# EAGLE schematic Eurorack_Pot_CV_Summed (EAGLE 9.6.2)
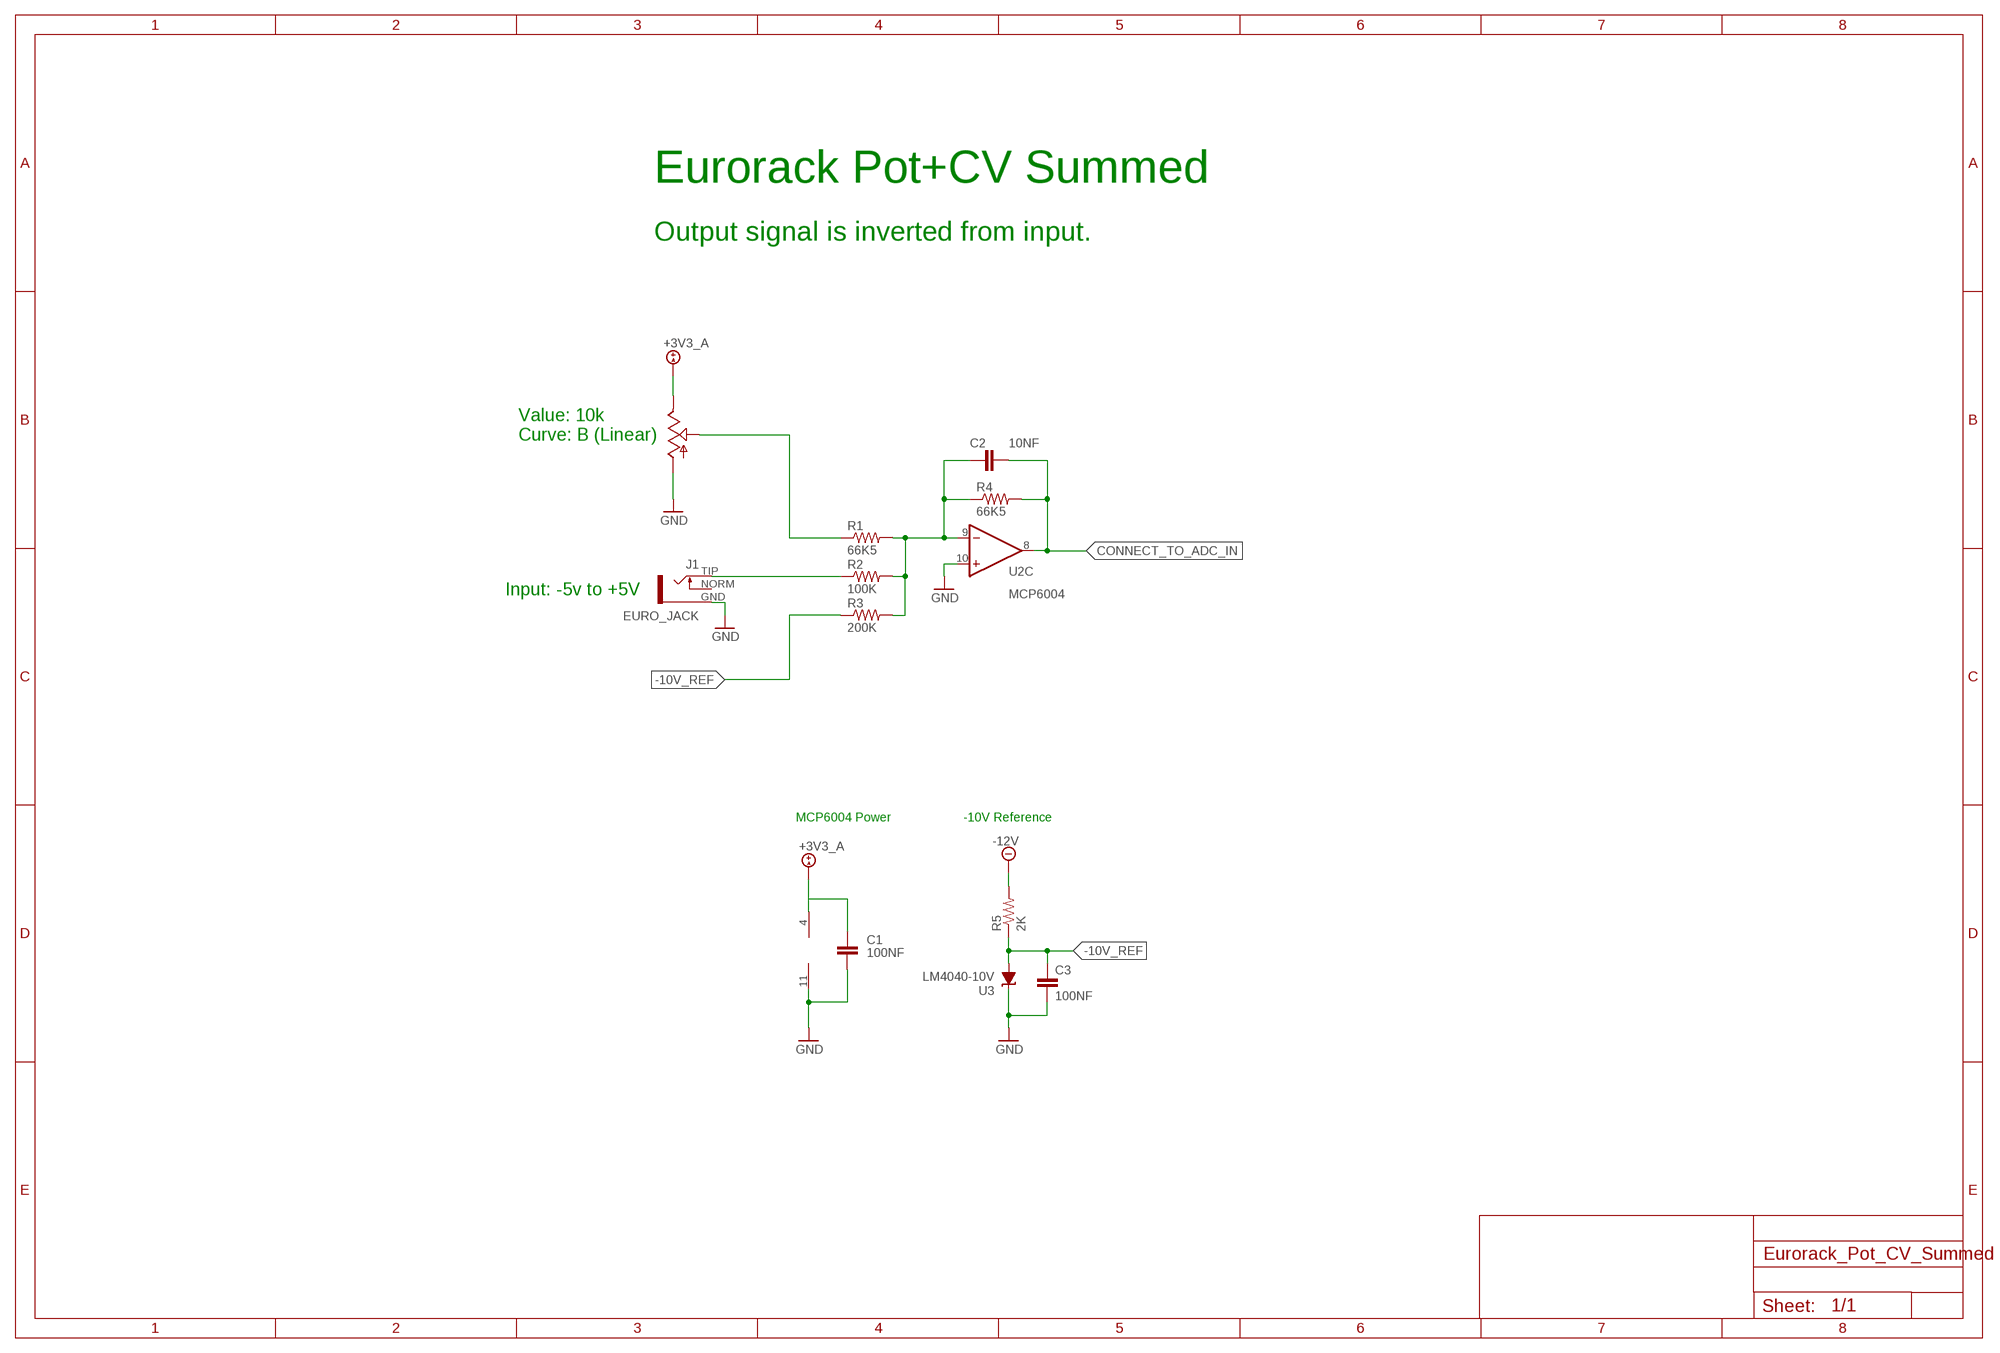
[diagram p0: schematic, sheet 1]

## Parts
C1  100NF  C-EUC0603  [C0603]
C2  10NF  C-EUC0603  [C0603]
C3  100NF  C-EUC0603  [C0603]
J1  EURO_JACK  [S_JACK]
R1  66K5  R-US_R0603  [R0603]
R2  100K  R-US_R0603  [R0603]
R3  200K  R-US_R0603  [R0603]
R4  66K5  R-US_R0603  [R0603]
R5  2K  R-US_R0603  [R0603]
U1  MCP6004  MCP6004_TSSOP-14  [TSSOP-14]
U2  MCP6004  MCP6004_TSSOP-14  [TSSOP-14]
U3  LM4040-10V  LM4040-10VA12DBZ  [DBZ_R-PDSO-G3]
VR1  POT_9MM_SNAP-IN__  [9MM_SNAP-IN_POT_SILK]

## Nets
+3V3_A: C1.2 U1.4(P:V+) VR1.3
-10V_REF: C3.1 R3.1 R5.1 U3.2(A)
-12V: R5.2
CONNECT_TO_ADC_IN: C2.2 R4.2 U2.8(C:OUT)
CV_IN_1: J1.TIP R2.1
GND: C1.1 C3.2 J1.GND U1.11(P:V-) U2.10(C:+IN) U3.1(C) VR1.1
N$2: R1.1 VR1.2
N$13: C2.1 R1.2 R2.2 R3.2 R4.1 U2.9(C:-IN)
Unconnected: J1.NORM U1.1(A:OUT) U1.2(A:-IN) U1.3(A:+IN) U1.5(B:+IN) U1.6(B:-IN) U1.7(B:OUT) U1.8(C:OUT) U1.9(C:-IN) U1.10(C:+IN) U1.12(D:+IN) U1.13(D:-IN) U1.14(D:OUT) U2.1(A:OUT) U2.2(A:-IN) U2.3(A:+IN) U2.5(B:+IN) U2.6(B:-IN) U2.7(B:OUT) U2.12(D:+IN) U2.13(D:-IN) U2.14(D:OUT)

## Notes on the sheet
- Eurorack Pot+CV Summed
- Output signal is inverted from input.
- Value: 10k
  Curve: B (Linear)
- Input: -5v to +5V
- MCP6004 Power | -10V Reference

## Power pins joined to a net without a drawn wire
V+: U2.4(P:V+)
V-: U2.11(P:V-)

## Library data of the parts
C1-C3 = Electrosmith-Passives:C-EU: CAPACITOR, European symbol; PACKAGE: C0603
J1 = Electrosmith-Interface:EURO_JACK
R1-R5 = Electrosmith-Passives:R-US_: RESISTOR, American symbol; PACKAGE: R0603
U1 U2 = Electrosmith-IC:MCP6004; BIN#: N/A; IPN: MCP6004 TSSOP-14; MPN: MCP6004T-E/ST; PACKAGE: TSSOP-14
U3 = Electrosmith-Power:LM4040-10V: PRECISION MICROPOWER SHUNT VOLTAGE REFERENCE Source: http://focus.ti.com/lit/ds/slcs146e/slcs146e.pdf; IPN: LM4040-10V; MPN: LM4041A12IDBZR; OC_FARNELL: 1407949; OC_NEWARK: 58K5875; PACKAGE: SOT-23
VR1 = Electrosmith-Interface:POT_9MM_SNAP-IN_: 9mm vertical snap-in pot, Alpha / Panasonic style

## Net classes
0 default: width 0.203 mm